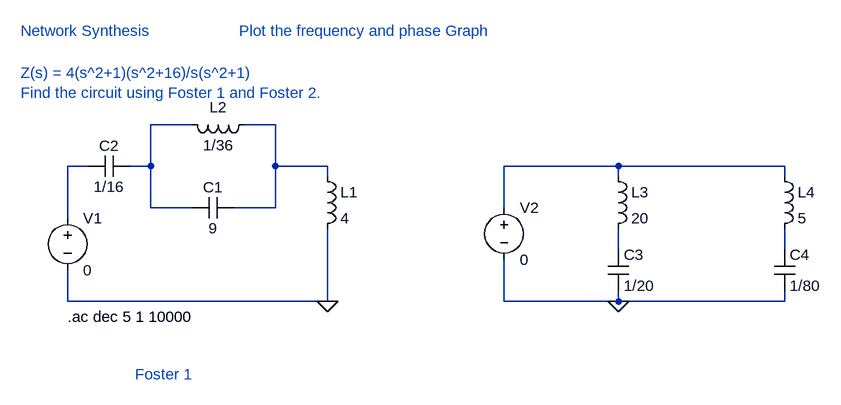
[diagram p0: schematic Lab8_ques1.asc]
Lab8_ques1.asc, the LTspice schematic file:
Version 4
SHEET 1 1364 680
WIRE 384 240 320 240
WIRE 512 240 464 240
WIRE 224 304 192 304
WIRE 320 304 320 240
WIRE 320 304 288 304
WIRE 512 304 512 240
WIRE 592 304 512 304
WIRE 1040 304 864 304
WIRE 1296 304 1040 304
WIRE 592 320 592 304
WIRE 1040 320 1040 304
WIRE 1296 320 1296 304
WIRE 320 368 320 304
WIRE 384 368 320 368
WIRE 512 368 512 304
WIRE 512 368 448 368
WIRE 864 368 864 304
WIRE 192 384 192 304
WIRE 1040 432 1040 400
WIRE 1296 432 1296 400
WIRE 192 512 192 464
WIRE 592 512 592 400
WIRE 592 512 192 512
WIRE 864 512 864 448
WIRE 1040 512 1040 496
WIRE 1040 512 864 512
WIRE 1296 512 1296 496
WIRE 1296 512 1040 512
FLAG 592 512 0
FLAG 1040 512 0
SYMBOL Cap 448 352 R90
WINDOW 0 0 32 VBottom 2
WINDOW 3 32 32 VTop 2
SYMATTR InstName C1
SYMATTR Value 9
SYMBOL Cap 288 288 R90
WINDOW 0 0 32 VBottom 2
WINDOW 3 32 32 VTop 2
SYMATTR InstName C2
SYMATTR Value 1/16
SYMBOL ind 576 304 R0
SYMATTR InstName L1
SYMATTR Value 4
SYMBOL ind 480 224 R90
WINDOW 0 5 56 VBottom 2
WINDOW 3 32 56 VTop 2
SYMATTR InstName L2
SYMATTR Value 1/36
SYMBOL Voltage 192 368 R0
SYMATTR InstName V1
SYMATTR Value 0
SYMATTR Value2 AC 1 0
SYMBOL Voltage 864 352 R0
SYMATTR InstName V2
SYMATTR Value 0
SYMATTR Value2 AC 1
SYMBOL Cap 1024 432 R0
SYMATTR InstName C3
SYMATTR Value 1/20
SYMBOL Cap 1280 432 R0
SYMATTR InstName C4
SYMATTR Value 1/80
SYMBOL Ind 1024 304 R0
SYMATTR InstName L3
SYMATTR Value 20
SYMBOL Ind 1280 304 R0
SYMATTR InstName L4
SYMATTR Value 5
TEXT 120 96 Left 2 ;Network Synthesis
TEXT 456 96 Left 2 ;Plot the frequency and phase Graph
TEXT 120 160 Left 2 ;Z(s) = 4(s^2+1)(s^2+16)/s(s^2+1)\nFind the circuit using Foster 1 and Foster 2.
TEXT 192 536 Left 2 !.ac dec 5 1 10000
TEXT 296 624 Left 2 ;Foster 1

The netlist it stands for:
* Lab8_ques1.asc
C1 N002 N001 9
C2 N001 N003 1/16
L1 N002 0 4
L2 N002 N001 1/36
V1 N003 0 0 AC 1 0
V2 N004 0 0 AC 1
C3 N005 0 1/20
C4 N006 0 1/80
L3 N004 N005 20
L4 N004 N006 5
* Network Synthesis
* Plot the frequency and phase Graph
* Z(s) = 4(s^2+1)(s^2+16)/s(s^2+1)
* Find the circuit using Foster 1 and Foster 2.
.ac dec 5 1 10000
* Foster 1
.backanno
.end